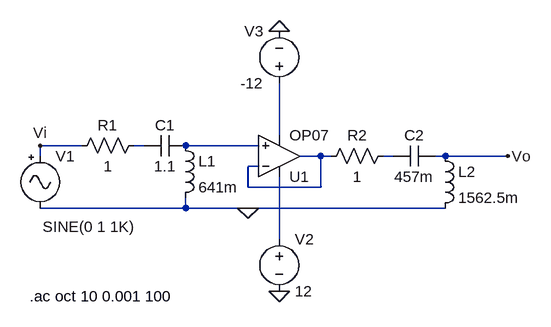
[diagram p0: schematic TS3.asc]
TS3.asc, the LTspice schematic file:
Version 4
SHEET 1 880 680
WIRE 480 272 480 192
WIRE 176 288 112 288
WIRE 272 288 256 288
WIRE 448 288 336 288
WIRE 112 304 112 288
WIRE 544 304 512 304
WIRE 560 304 544 304
WIRE 656 304 640 304
WIRE 736 304 720 304
WIRE 832 304 736 304
WIRE 448 320 432 320
WIRE 432 352 432 320
WIRE 544 352 544 304
WIRE 544 352 432 352
WIRE 336 384 336 368
WIRE 336 384 112 384
WIRE 432 384 336 384
WIRE 736 384 432 384
WIRE 480 432 480 336
FLAG 432 384 0
FLAG 832 304 Vo
FLAG 112 288 Vi
FLAG 480 512 0
FLAG 480 112 0
SYMBOL OpAmps/OP07 480 368 M180
SYMATTR InstName U1
SYMBOL res 272 272 R90
WINDOW 0 0 56 VBottom 2
WINDOW 3 32 56 VTop 2
SYMATTR InstName R1
SYMATTR Value 1
SYMBOL res 656 288 R90
WINDOW 0 0 56 VBottom 2
WINDOW 3 32 56 VTop 2
SYMATTR InstName R2
SYMATTR Value 1
SYMBOL cap 336 272 R90
WINDOW 0 0 32 VBottom 2
WINDOW 3 32 32 VTop 2
SYMATTR InstName C1
SYMATTR Value 1.1
SYMBOL cap 720 288 R90
WINDOW 0 0 32 VBottom 2
WINDOW 3 32 32 VTop 2
SYMATTR InstName C2
SYMATTR Value 457m
SYMBOL ind 320 272 R0
SYMATTR InstName L1
SYMATTR Value 641m
SYMBOL ind 720 288 R0
SYMATTR InstName L2
SYMATTR Value 1562.5m
SYMBOL Misc/signal 112 288 R0
WINDOW 3 4 125 Left 2
SYMATTR InstName V1
SYMATTR Value2 AC 1
SYMBOL voltage 480 416 R0
SYMATTR InstName V2
SYMATTR Value 12
SYMBOL voltage 480 208 R180
WINDOW 0 24 96 Left 2
WINDOW 3 24 16 Left 2
SYMATTR InstName V3
SYMATTR Value -12
TEXT 96 520 Left 2 !.ac oct 10 0.001 100

The netlist it stands for:
* TS3.asc
XU1 N003 N004 N006 N001 N004 LT1001  ; OP07, pins In+ In- V+ V- OUT
R1 N002 Vi 1
R2 N005 N004 1
C1 N003 N002 1.1
C2 Vo N005 457m
L1 N003 0 641m
L2 Vo 0 1562.5m
V1 Vi 0 SINE(0 1 1K) AC 1
V2 N006 0 12
V3 N001 0 -12
.ac oct 10 0.001 100
.lib LTC.lib
.backanno
.end